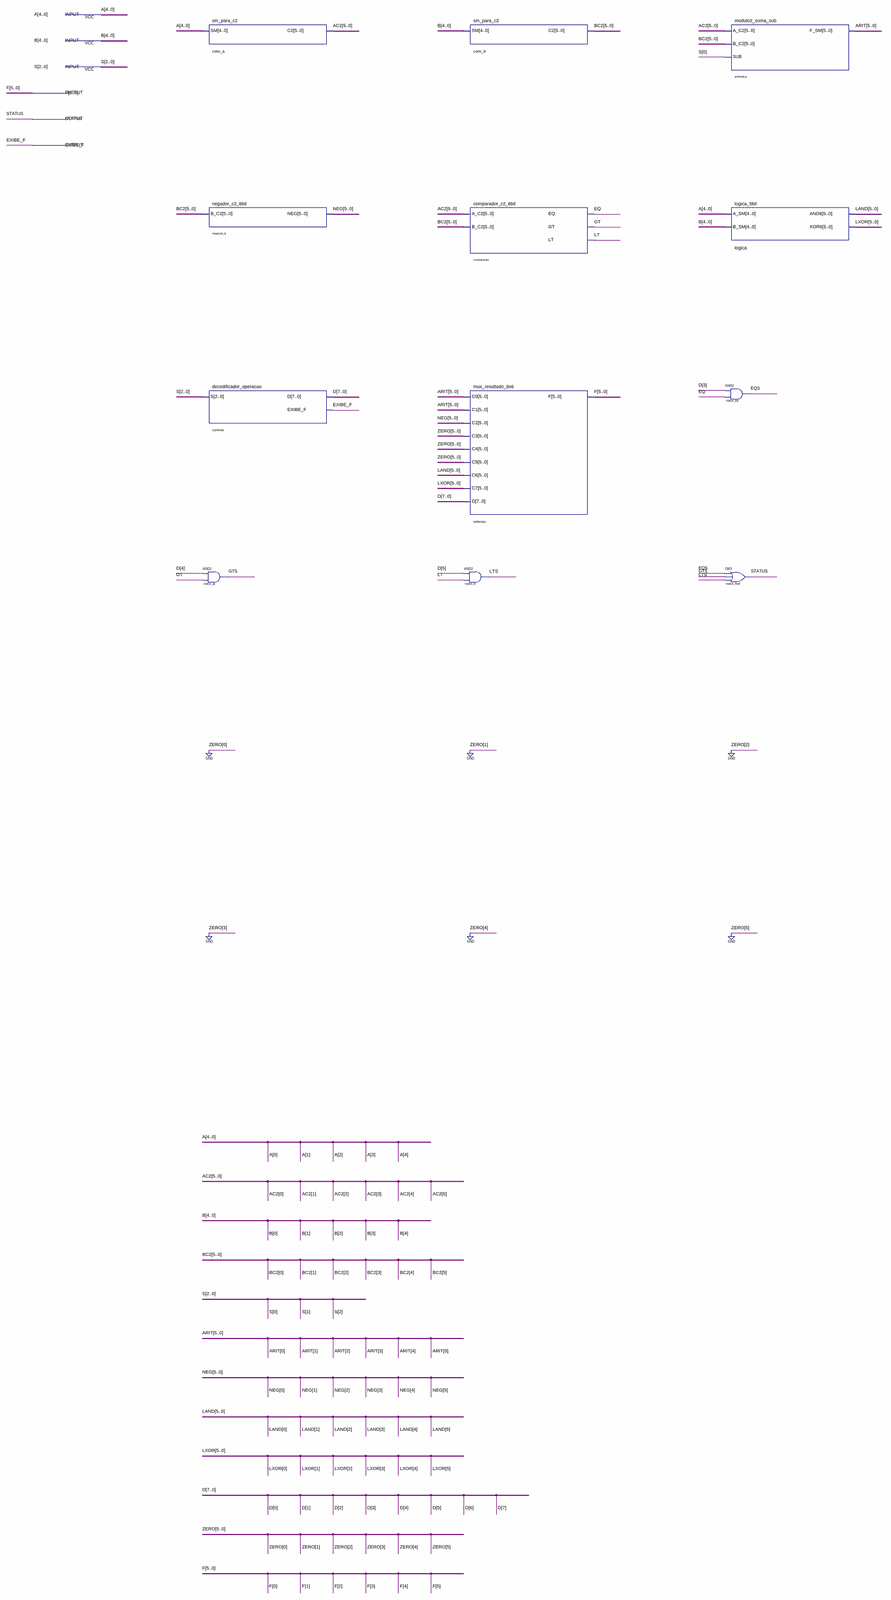
[diagram p0: schematic sheet, whole]
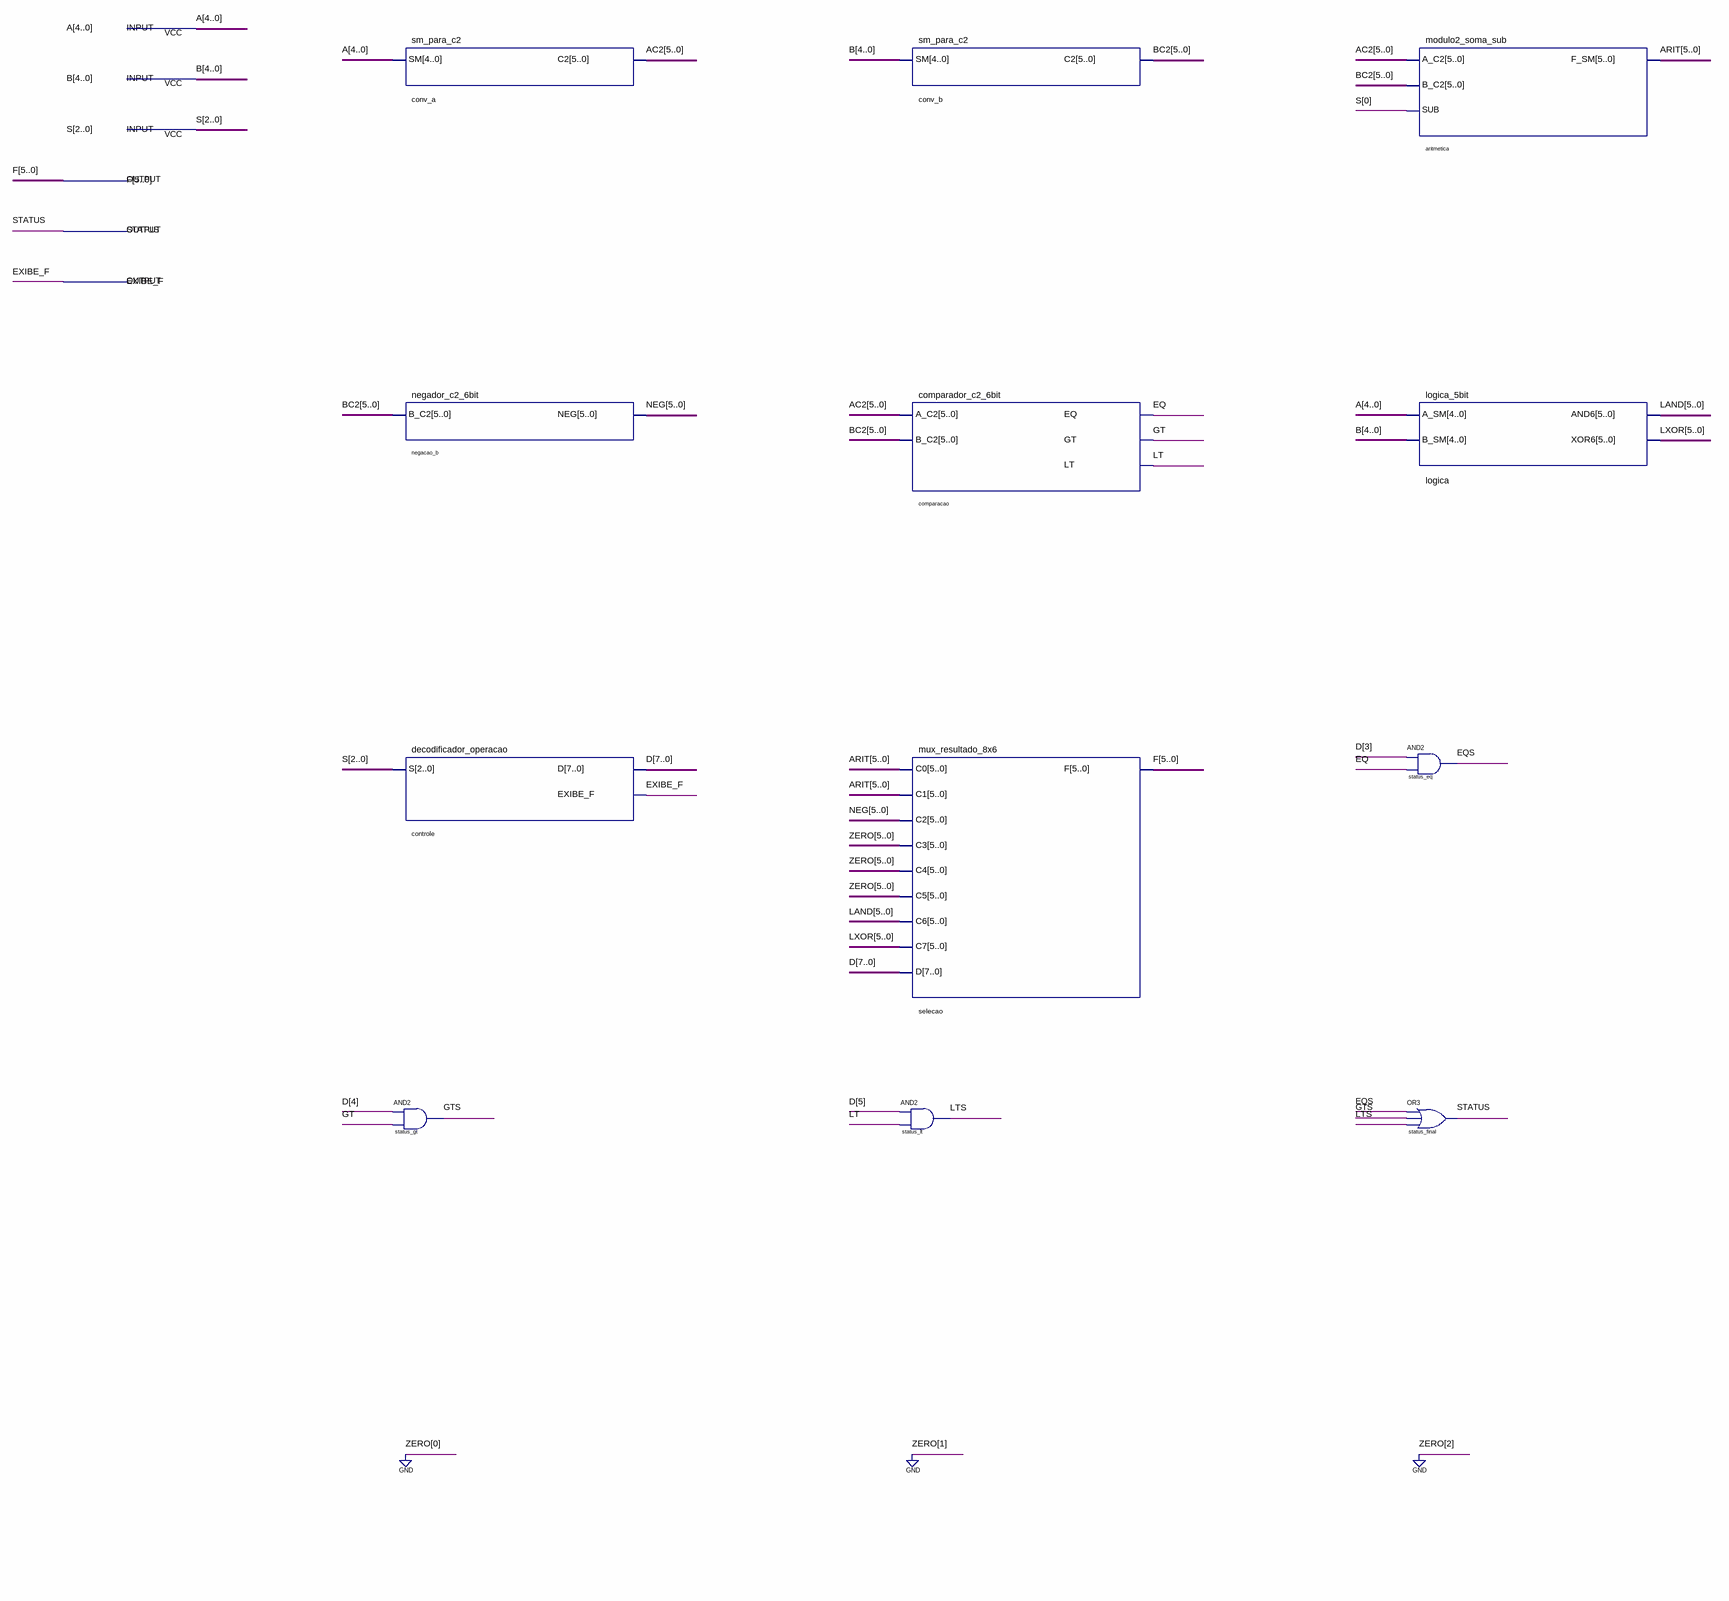
[diagram p1: schematic sheet, upper part]
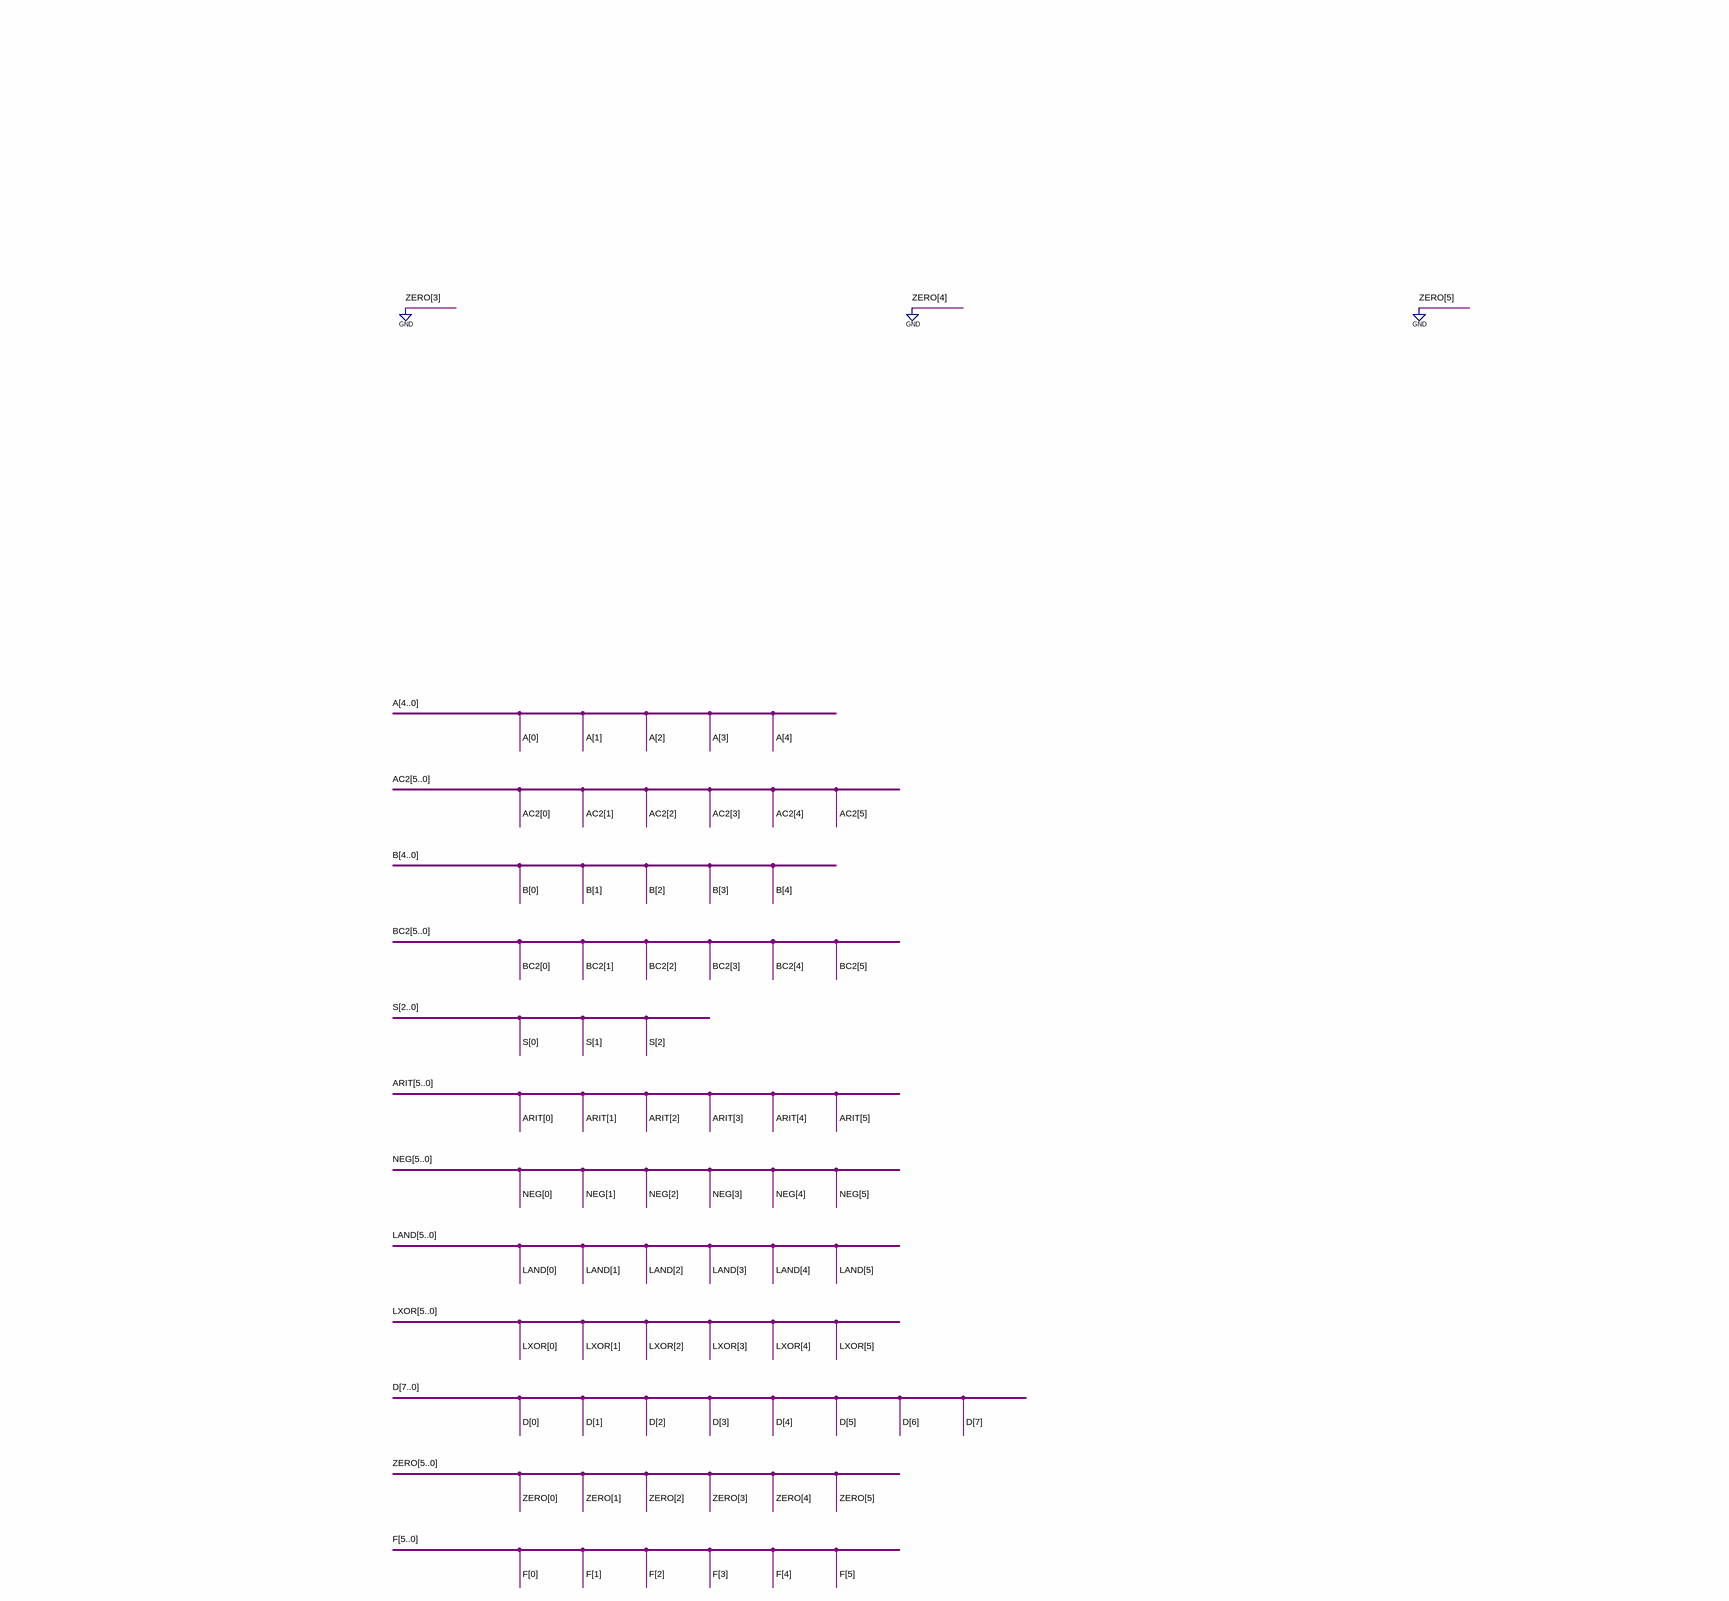
[diagram p2: schematic sheet, lower part]
// Quartus schematic ula_core.bdf as structural Verilog: 12 symbols, 6 pins
module ula_core (
  input  [4:0] A,
  input  [4:0] B,
  input  [2:0] S,
  output [5:0] F,
  output STATUS,
  output EXIBE_F
);

  wire EQ, EQS, GT, GTS, LT, LTS;
  wire [5:0] AC2, ARIT, BC2, LAND, LXOR, NEG;
  wire [7:0] D;

  sm_para_c2 conv_a (.SM(A), .C2(AC2));
  negador_c2_6bit negacao_b (.B_C2(BC2), .NEG(NEG));
  decodificador_operacao controle (.S(S), .D(D), .EXIBE_F(EXIBE_F));
  and status_gt (GTS, D[4], GT);
  sm_para_c2 conv_b (.SM(B), .C2(BC2));
  comparador_c2_6bit comparacao (.A_C2(AC2), .B_C2(BC2), .EQ(EQ), .GT(GT), .LT(LT));
  mux_resultado_8x6 selecao (
    .C0(ARIT), .C1(ARIT), .C2(NEG), .C3({6{1'b0}}), .C4({6{1'b0}}), .C5({6{1'b0}}), .C6(LAND), .C7(LXOR),
    .D(D), .F(F));
  and status_lt (LTS, D[5], LT);
  modulo2_soma_sub aritmetica (.A_C2(AC2), .B_C2(BC2), .SUB(S[0]), .F_SM(ARIT));
  logica_5bit logica (.A_SM(A), .B_SM(B), .AND6(LAND), .XOR6(LXOR));
  and status_eq (EQS, D[3], EQ);
  or status_final (STATUS, EQS, GTS, LTS);
endmodule
